# EAGLE design tentprotector-tht (EAGLE 7.1.0)
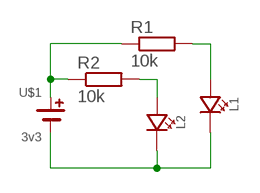
[diagram p0: schematic, sheet 1]

## Parts
L1  LED5MM  [LED-5MM]
L2  LED5MM  [LED-5MM]
R1  10k  R-EU_0207/7  [0207/7]
R2  10k  R-EU_0207/7  [0207/7]
U$1  3v3  BATTERY2032-MIN  [BATTERY-CR2030-MIN]

## Nets
+3V3: R1.1 R2.1 U$1.P$1(PLUS) U$1.P$2(PLUS)
GND: L1.K(C) L2.K(C) U$1.N$1(MINUS)
N$2: L1.A R1.2
N$4: L2.A R2.2

## Library data of the parts
L1 L2 = p.peter-leds:LED
R1 R2 = rcl:R-EU_: RESISTOR, European symbol
U$1 = p.peter-regulators:BATTERY

## Board
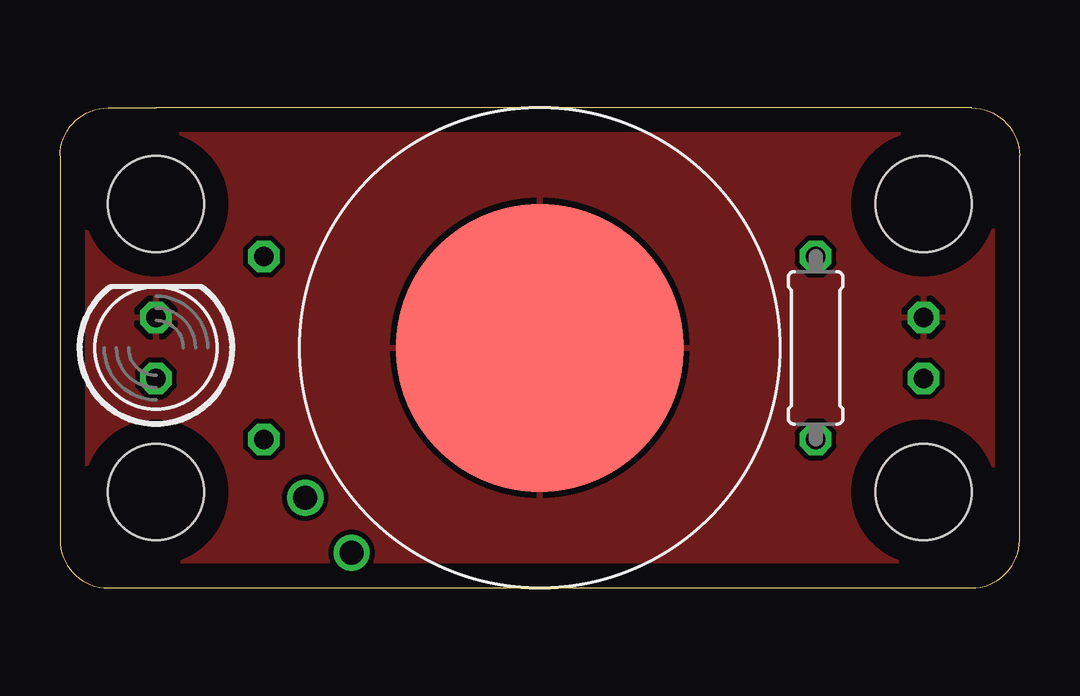
[diagram p1: board, top side]
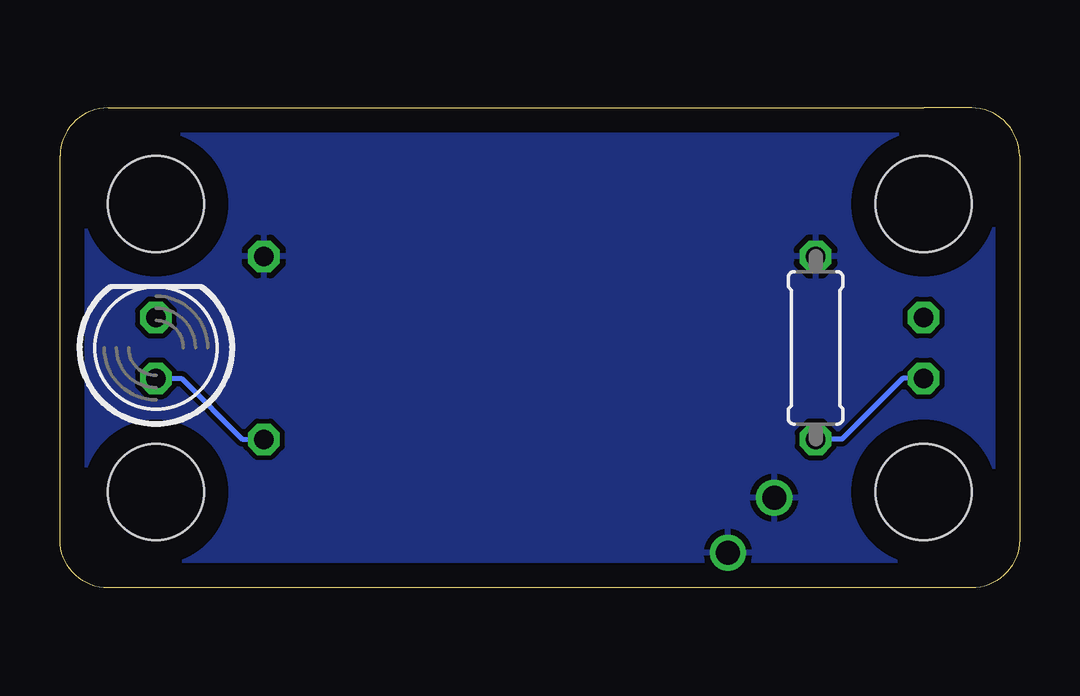
[diagram p2: board, bottom side, seen from below]

Size 40 x 20 mm. Coordinates in mm from the lower left corner, seen from the top.
Outline: 36,0 4,0 2,0 arc-90 0,2 0,18 arc-90 2,20 4,20 38,20 arc-90 40,18 40,2 arc-90 38,0
Outline: 36,0 38,0
Outline: 36,0 38,0
Copper layers (1*16): Top 0.035mm / dielectric 1.5mm / Bottom 0.035mm
Design rules "default": minimum track width 10mil, minimum drill 24mil, track to track 8mil, track to pad 8mil, pad to pad 8mil, via to via 8mil, smd to smd 8mil, copper to edge 40mil, drill to drill 8mil, minimum pad ring 10mil, minimum via ring 8mil, stop-mask expansion 4mil, vias tented up to drill 0mil, thermal gap 10mil
Holes 4 mm at 36,16 36,4 4,16 4,4

### Footprints (pad centres in the part's own frame; a part is rotated, then mirrored left to right if it is on the bottom)
LED-5MM = drill 0.813 octagon: A -1.27,0; K 1.27,0
0207/7 = drill 0.813 octagon: 1 -3.81,0; 2 3.81,0
BATTERY-CR2030-MIN = smd 12 x 12: N$1 0,0 | drill 1: P$1 -11.5,-1.5; P$2 -11.5,1.5

### Placement (x,y rotation side)
L1  36,10 90 bottom
L2  4,10 90 top
R1  31.5,10 270 top
R2  8.5,10 270 bottom
U$1  20,10 40 top

### Tracks (layer width: path | path; a pad name or v marks a point on that pad's centre or on a via)
+3V3
  pour Bottom: 0,0 0,20 40,20 40,0
GND
  pour Top: 0,0 0,20 40,20 40,0
N$2
  Bottom 0.2: L1.A 34.93,8.73 32.4,6.2 R1.2
N$4
  Bottom 0.2: L2.A 4.87,8.73 7.4,6.2 R2.2